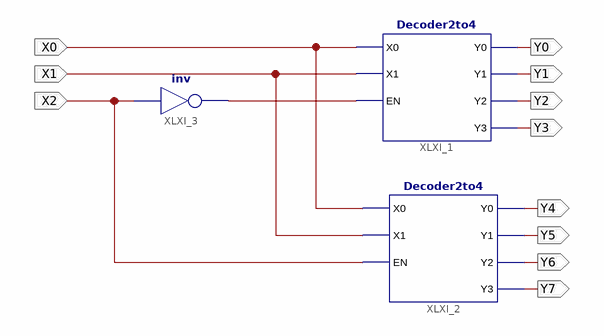
[diagram p0: schematic sheet 1]
// Xilinx ISE schematic Decoder3to8.sch (spartan3e) as structural Verilog: 3 symbols, 11 ports
module Decoder3to8 (
  input  X2,
  input  X0,
  input  X1,
  output Y0,
  output Y1,
  output Y2,
  output Y3,
  output Y4,
  output Y5,
  output Y6,
  output Y7
);

  wire XLXN_20;

  Decoder2to4 XLXI_1 (.EN(XLXN_20), .X0(X0), .X1(X1), .Y0(Y0), .Y1(Y1), .Y2(Y2), .Y3(Y3));
  Decoder2to4 XLXI_2 (.EN(X2), .X0(X0), .X1(X1), .Y0(Y4), .Y1(Y5), .Y2(Y6), .Y3(Y7));
  not XLXI_3 (XLXN_20, X2);
endmodule
